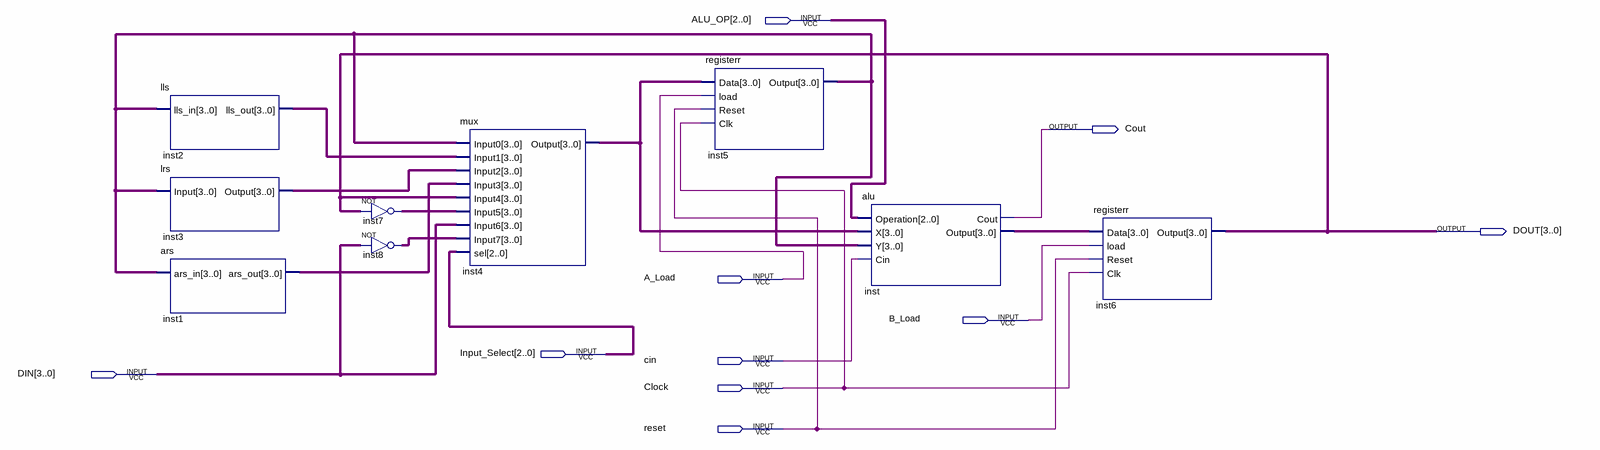
[diagram p0: schematic sheet]
// Quartus schematic ALU_SCHEMATIC.bdf as structural Verilog: 9 symbols, 10 pins
module ALU_SCHEMATIC (
  input  [2:0] ALU_OP,
  input  A_Load,
  input  B_Load,
  input  [2:0] Input_Select,
  input  cin,
  input  [3:0] DIN,
  input  Clock,
  input  reset,
  output Cout,
  output [3:0] DOUT
);

  wire [3:0] inst1_ars_out, inst2_lls_out, inst3_output, inst4_output, inst5_output, inst7_out, inst8_out,
       inst_output;

  lls inst2 (.lls_in(inst5_output), .lls_out(inst2_lls_out));
  lrs inst3 (.Input(inst5_output), .Output(inst3_output));
  ars inst1 (.ars_in(inst5_output), .ars_out(inst1_ars_out));
  assign inst7_out = ~DOUT;  // NOT inst7, 4 bits wide
  assign inst8_out = ~DIN;  // NOT inst8, 4 bits wide
  mux inst4 (
    .Input0(inst5_output), .Input1(inst2_lls_out), .Input2(inst3_output), .Input3(inst1_ars_out),
    .Input4(DOUT), .Input5(inst7_out), .Input6(DIN), .Input7(inst8_out), .sel(Input_Select),
    .Output(inst4_output));
  registerr inst5 (.Data(inst4_output), .load(A_Load), .Reset(reset), .Clk(Clock), .Output(inst5_output));
  alu inst (.Operation(ALU_OP), .X(inst4_output), .Y(inst5_output), .Cin(cin), .Cout(Cout), .Output(inst_output));
  registerr inst6 (.Data(inst_output), .load(B_Load), .Reset(reset), .Clk(Clock), .Output(DOUT));
endmodule
